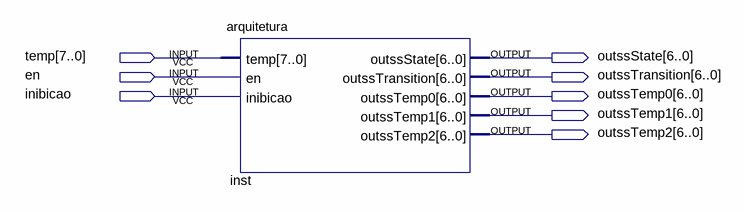
[diagram p0: schematic sheet]
// Quartus schematic atv05.bdf as structural Verilog: 1 symbols, 8 pins
module atv05 (
  input  [7:0] temp,
  input  en,
  input  inibicao,
  output [6:0] outssState,
  output [6:0] outssTransition,
  output [6:0] outssTemp0,
  output [6:0] outssTemp1,
  output [6:0] outssTemp2
);

  arquitetura inst (
    .temp(temp), .en(en), .inibicao(inibicao), .outssState(outssState), .outssTransition(outssTransition),
    .outssTemp0(outssTemp0), .outssTemp1(outssTemp1), .outssTemp2(outssTemp2));
endmodule
